# Altium schematic sheet Bidirect_convertor.SchDoc
size A3
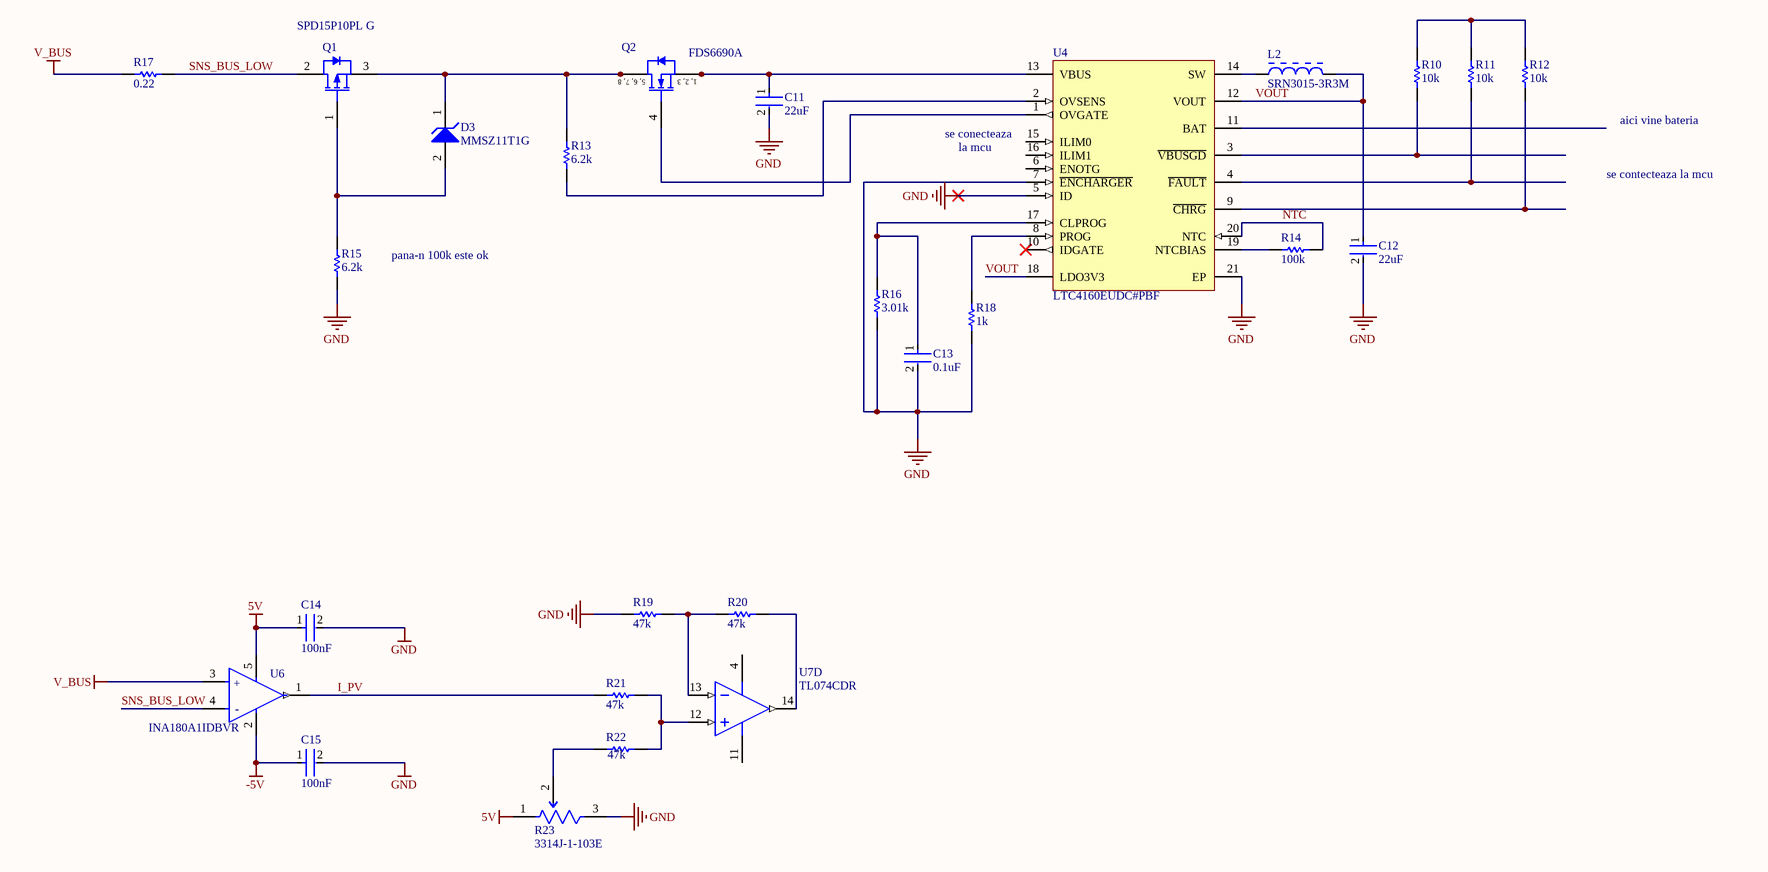
[diagram p0: Bidirect_convertor.SchDoc]

## Parts
C11  22uF  [FP-C2012-125-0_2-IPC_C]
C12  22uF  [FP-C2012-125-0_2-IPC_C]
C13  0.1uF  [FP-GRM155-0_05-MFG]
C14  100nF  [FP-CGA3E-0_3-0_1-IPC_A]
C15  100nF  [FP-CGA3E-0_3-0_1-IPC_A]
D3  MMSZ11T1G  [ONSC-SOD-123-2-425-04_V]
L2  SRN3015-3R3M  [BOUR-SRN3015-2_V]
Q1  SPD15P10PL G  [INF-PG-TO252-3-1_N]
Q2  FDS6690A  [FAIR-SOIC-8_V]
R10  10k  [RESC1609X55X30LL15T15]
R11  10k  [RESC1609X55X30LL15T15]
R12  10k  [RESC1609X55X30LL15T15]
R13  6.2k  [RESC1609X50X30ML10T20]
R14  100k  [RESC1608X55X30ML15T15]
R15  6.2k  [RESC1609X50X30ML10T20]
R16  3.01k  [RESC1608X55X30LL15T15]
R17  0.22  [RESC2013X70X40NL20T20]
R18  1k  [RESC1608X55X30LL15T15]
R19  47k  [RESC1608X55X30NL15T15]
R20  47k  [RESC1608X55X30NL15T15]
R21  47k  [RESC1608X55X30NL15T15]
R22  47k  [RESC1608X55X30NL15T15]
R23  3314J-1-103E  [FP-3314J-1-MFG]
U4  LTC4160EUDC#PBF  [LT-UDC-20_N]
U6  INA180A1IDBVR  [FP-DBV0005A-IPC_A]
U7  TL074CDR  [D0014A_N]  (part D of 4)

## Nets
5V: C14.1 R23.1(CCW) U6.5(VS)
-5V: C15.1 U6.2(GND)
GND: C11.2 C12.2 C13.2 C14.2 C15.2 R15.1 R16.1 R18.1 R19.2 R23.3(CW) U4.5(ID) U4.7(~{ENCHARGER}) U4.21(EP)
V_BUS: R17.1 U6.3(IN+)
I_PV: R21.2 U6.1(OUT)
NTC: R14.2 U4.20(NTC)
SNS_BUS_LOW: Q1.2(DRAIN) R17.2 U6.4(IN-)
VOUT: C12.1 L2.2 U4.12(VOUT) U4.18(LDO3V3)
NetC11_1: C11.1 Q2.1(S) Q2.2(S) Q2.3(S) U4.13(VBUS)
NetC13_1: C13.1 R16.2 U4.17(CLPROG)
NetD3_1: D3.1(K) Q1.3(SOURCE) Q2.5(D) Q2.6(D) Q2.7(D) Q2.8(D) R13.2
NetD3_2: D3.2(A) Q1.1(GATE) R15.2
NetL2_1: L2.1 U4.14(SW)
NetQ2_4: Q2.4(G) U4.1(OVGATE)
NetR10_1: R10.1 U4.3(~{VBUSGD})
NetR10_2: R10.2 R11.2 R12.2
NetR11_1: R11.1 U4.4(~{FAULT})
NetR12_1: R12.1 U4.9(~{CHRG})
NetR13_1: R13.1 U4.2(OVSENS)
NetR14_1: R14.1 U4.19(NTCBIAS)
NetR18_2: R18.2 U4.8(PROG)
NetR19_1: R19.1 R20.2 U7.13(IN4-)
NetR20_1: R20.1 U7.14(OUT4)
NetR21_1: R21.1 R22.1 U7.12(IN4+)
NetR22_2: R22.2 R23.2(WIPER)

Not connected (* = marked no-connect by the designer): U4 6(ENOTG) 10(IDGATE)* 11(BAT) 15(ILIM0) 16(ILIM1); U7 4(VCC+) 11(VCC-)

## Notes on the sheet
- aici vine bateria
- (near U4) se conecteaza
- la mcu
- se contecteaza la mcu
- pana-n 100k este ok
- (in symbol CMP-2000-06260-1) 5, 6, 7, 8; 1, 2, 3
- (in symbol CMP-04895-000140-1) +; -

## Library data of the parts
C11 C12 = CMP-2000-06037-3: Multilayer Ceramic Capacitors 22μF ±10% 16V X5R SMD 0805; Thickness: 0.057inch; Series: C; Weight: 0.000194oz; Construction: Flat; Max Operating Temperature: 85°C; Case Code (Imperial): 0805; Width: 0.049inch; Depth: 1.25mm; Dielectric: X5R; Capacitance: 22uF; Case/Package: 0805; Voltage Rating: 16V; Mount: Surface Mount; Dielectric Material: Ceramic; Packaging: Tape and Reel; Resistor Type: Ceramic; Number of Pins: 2; Lead Free: Lead Free; REACH SVHC: No SVHC; Tolerance: 10%; Termination: Wraparound; Min Operating Temperature: -55°C; Case Code (Metric): 2012; RoHS Compliant: Yes; Voltage: 16V; Length: 2mm; Voltage Rating (DC): 16V; Package Quantity: 1; Height: 1.25mm
C13 = CMP-2008-04599-2: CAP CER 0.1UF 16V X7R 0402; Tolerance: 5%; Capacitance: 100nF; Height: 0.5mm; Min Operating Temperature: -55°C; Voltage Rating: 16V; Termination: Standard; Dielectric: X7R; Max Operating Temperature: 125°C; Package Quantity: 10000; Case/Package: 0402; Case Code (Metric): 1005; Depth: 0.5mm; Voltage: 16V; Width: 0.5mm; RoHS Compliant: Yes; Length: 1mm; Case Code (Imperial): 0402; Thickness: 0.022inch; Mount: Surface Mount; REACH SVHC: No SVHC; Weight: 0.000212oz; Voltage Rating (DC): 16V; Series: GRM; Packaging: Cut Tape; Radiation Hardening: No; Lead Free: Lead Free
C14 C15 = CMP-2000-07546-2: Cap Ceramic 100nF 50V X7R 10% Pad SMD 0603 +125°C Automotive T/R; Weight: 7.1E-05oz; Composition: Ceramic; Max Operating Temperature: 125°C; Termination: SMD/SMT; Dielectric: X7R; Length: 1.6mm; Package Quantity: 1; REACH SVHC: No SVHC; Lead Free: Lead Free; Case Code (Metric): 1608; Min Operating Temperature: -55°C; Packaging: Tape and Reel; Tolerance: 10%; Voltage Rating: 50V; Case Code (Imperial): 0603; Capacitance: 100nF; Case/Package: 0603; Voltage Rating (DC): 50V; Depth: 0.8mm; Radiation Hardening: No; Ratings: AEC-Q200; Mount: Surface Mount; Voltage: 50V; Thickness: 0.035inch; Width: 0.8mm; Height: 0.8mm
D3 = CMP-1060-00402-1: Zener Voltage Regulator, 500 mW, 2-Pin SOD-123, Pb-Free, Tape and Reel; Manufacturer: On Semiconductor; P Max (W): 0.5; ComponentLink2URL: http://www.onsemi.com/pub_link/Collateral/MMSZ2V4T1-D.PDF; DatasheetVersion: Rev. 11; ComponentLink1Description: Manufacturer URL; ComponentLink3URL: http://www.onsemi.com/pub_link/Collateral/425-04.PDF; ComponentLink1URL: http://www.onsemi.com/; PackageDescription: 2-Pin SOD, Body 1.6 x 2.69 mm; PackageVersion: Rev. G, 10/2009; ComponentLink3Description: Package Specification; ComponentLink2Description: Datasheet; Mounting Technology: Surface Mount; PartNumber: MMSZ11T1G; RoHS: Pb-Free; Packing: Tape and Reel; PackageReference: SOD-123-2-425-04
L2 = CMP-0007-00001-1: Semi-shielded Power Inductor, 3.3 uH, +/- 20%, 1.6 A, -40 to 125 degC, 3 x 3 x 1.5 mm SMD, RoHS and Halogen Free, Tape and Reel; Manufacturer: Bourns; DCR Max: 0.112 Ohm; Resistance to Solder Heat: +260 degC for 10 sec.; Inductance: 3.3 uH; Rated current: 1.6 A; SRF Min: 75 MHz; Isat: 1.4 A; Inductance tolerance: +/- 20%; PackageDescription: 2-Pin SMD, Body 3 x 3 mm, Height 1.5 mm; ComponentLink1URL: http://www.bourns.com/; ComponentLink3URL: http://www.bourns.com/data/global/pdfs/SRN3015.pdf; RoHS: TRUE; ComponentLink2URL: http://www.bourns.com/data/global/pdfs/SRN3015.pdf; DatasheetVersion: Aug-11; ComponentLink3Description: Package Specification; PartNumber: SRN3015-3R3M; ComponentLink2Description: Datasheet; Packing: Tape and Reel; ComponentLink1Description: Manufacturer URL; Mounting Technology: Surface Mount; PackageReference: SRN3015; Operating Temperature: -40 to 125 degC
Q1 = CMP-1099-00052-1: P-Channel SIPMOS Power-Transistor, -100 V VDS, -15 A ID, -55 to 175 degC, PG-TO252-3-1, Reel, Green; Manufacturer: Infineon; Pto t (max): 128Â W; RDS (on) (max): 200Â mOhm; ID (max): -15Â A; VDS (max): -100Â V; RDS (on) (max) (@4.5V): 270Â mOhm; IDpuls (max): -60Â A; VGS(th) (max): -2Â V; QG: 47Â nC; Mode: Enhancement; Rth: 1.17Â K/W; VGS(th) (min): -1Â V; Polarity: P; Green: TRUE; PackageReference: PG-TO252-3-1; Mounting Technology: Surface Mount; ComponentLink1Description: Manufacturer URL; ComponentLink3Description: Package Specification; DatasheetVersion: Rev. 1.5; ComponentLink2Description: Datasheet; PackageDescription: 3-Pin Plastic (Green) Transistor Single Outline Package, 6.5 x 6.12 mm Body, 2.28 mm Pitch; Technology: SIPMOS; ComponentLink2URL: http://www.infineon.com/dgdl/SPD15P10PL%2BG_Rev1.5.pdf?folderId=db3a304314dca38901154a72e3951a65&fileId=db3a30433c1a8752013c39ff5f2e4af3; ComponentLink3URL: http://www.infineon.com/dgdl/TLE42744_DS_11.pdf?folderId=db3a304318f3fe290118f5a433570040&fileId=db3a304327b897500128012ccafe37d2&sId=db3a30443d67b5ca013d83f7c0ea327b; Packing: Reel; ComponentLink1URL: http://www.infineon.com/; PackageVersion: Jan-10; PartNumber: SPD15P10PL G
Q2 = CMP-2000-06260-1: Single N-Channel, Logic-Level, PowerTrench(R) MOSFET, 11 A, 30 V, -55 to 150 degC, 8-Pin SOIC (SO-8), RoHS, Tape and Reel; Manufacturer: Fairchild Semiconductor; Typical Turn-Off Delay Time: 28ns; Transistor Material: Si; Typical Turn-On Delay Time: 9ns; Channel Mode: Enhancement; Maximum Power Dissipation: 2.5W; Typical Input Capacitance @ Vds: 1205pF@15V; Maximum Continuous Drain Current: 11A; Maximum Gate Source Voltage: ±20V; Channel Type: N; Typical Gate Charge @ Vgs: 12nC@5V; Number of Elements per Chip: 1; Minimum Gate Threshold Voltage: 1V; Maximum Drain Source Resistance: 0.013Ω; Maximum Drain Source Voltage: 30V; Datasheet Version: Rev. E1, 02/2007; Length: 5mm; Category: PowerMOSFET; Mounting Type: SurfaceMount; Pin Count: 8; Minimum Operating Temperature: -55°C; Dimensions: 5x4x1.5mm; Package Type: SOIC; Width: 4mm; Datasheet URL: https://www.fairchildsemi.com/datasheets/FD/FDS6690A.pdf; Manufacturer URL: https://www.fairchildsemi.com/; Package URL: https://www.fairchildsemi.com/package-drawings/M0/M08A.pdf; Mounting Technology: SurfaceMount; Package Reference: SOIC-8; Maximum Operating Temperature: +150°C; Package Description: 8-Pin Small Outline Integrated Circuit, Body 4.9 x 3.9 mm, Pitch 1.27 mm; Transistor Configuration: Single; Height: 1.5mm
R10-R12 = CMP-1012-00623-3: Chip Resistor, 10 KOhm, +/- 1%, 0.1 W, -55 to 155 degC, 0603 (1608 Metric), RoHS, Tape and Reel; Manufacturer: Panasonic; Voltage Rating: 75V; Case\/Package: 0603; Power Rating: 100mW; Resistance: 10KOhm; Temperature Coefficient: 100ppm\/degreesC; Number of Pins: 2; Package Reference: 603; Depth: 0.8mm; Mount: SurfaceMount; Package Description: 2-Pin Surface Mount Device, Body 1.6 x 0.85 mm; Datasheet Version: 02/2017; Length: 1.6mm; Lead Free: LeadFree; Height: 0.45mm; Number of Terminations: 2; Max Power Dissipation: 100mW; Min Operating Temperature: -55degC; Datasheet URL: https://industrial.panasonic.com/cdbs/www-data/pdf/RDA0000/AOA0000C304.pdf; Termination: SMD/SMT; Case Code (Metric): 1608; Case Code (Imperial): 0603; Tolerance: 1%; Max Operating Temperature: 155degC; RoHSCompliant: true; Voltage Rating (DC): 75V; Radiation Hardening: No; Packaging: TapeandReel; Composition: ThickFilm; Mounting Technology: SurfaceMount; Manufacturer URL: http://www.panasonic.com/; Width: 0.031inch; REACH SVHC: NoSVHC; Contact Plating: Tin; Military Standard: Not; Package Quantity: 1
R13 R15 = CMP-2000-03545-1: Part Number: CRCW06036K20FKEA; Manufacturer: Vishay Dale
R14 = CMP-2000-00182-1: Part Number: ERJ-3EKF1003V; Manufacturer: Panasonic
R16 = CMP-2000-00416-1: Part Number: ERJ-3EKF3011V; Manufacturer: Panasonic
R17 = CMP-2001-00466-1: Manufacturer: Panasonic; Part Number: ERJ6RQFR22V
R18 = CMP-2000-00180-1: Part Number: ERJ-3EKF1001V; Manufacturer: Panasonic
R19-R22 = CMP-2000-00523-2: Chip Resistor, 47 KOhm, +/- 1%, 0.1 W, -55 to 155 degC, 0603 (1608 Metric), RoHS, Tape and Reel; Case\Package: 0603; Forward Current: 20 mA; Power Rating: 90 mW; Illumination Colour: Red; Nominal Vf: 2.1 V; Viewing Angle: 160 degrees; Luminous Intensity: 63 mcd; Lens Style: Clear; Nominal Wavelength: 639 nm; Case Code (Imperial): 0603; Case Code (Metric): 1608; Packaging: Tape and Reel; Radiation Hardening: No; Colour: Red; PackageDescription: 2-Pin Surface Mount Device, Body 1.6 x 0.85 mm; ComponentLink1Description: Manufacturer URL; Width: 0.8 mm; DatasheetVersion: Apr-15; ComponentLink2URL: http://industrial.panasonic.com/cdbs/www-data/pdf/RDA0000/AOA0000C86.pdf; Min Operating Temperature: -40 degC; Height: 0.6 mm; Package Quantity: 3000; ComponentLink2Description: Datasheet; REACH SVHC: No SVHC; ComponentLink1URL: http://www.panasonic.com/; Mount: Surface Mount; RoHSCompliant: true; Max Operating Temperature: 100 degC; PackageReference: 0603; Length: 1.6 mm; Forward Voltage: 2.1 V; Pins: 2
R23 = CMP-07234-000035-1: TRIMMER 10K OHM 0.25W J LEAD TOP; RoHS Compliant: Yes
U4 = CMP-0478-00217-1: Switching Power Manager with USB On-The-Go And Overvoltage Protection, 4.35 to 5.5 V Vin, 20-pin QFN (UDC-20), -40 to 85 degC, Pb-Free; Manufacturer: Linear Technology; Number of Outputs: 1; Vin Min(V): 4.35; Vin Max(V): 5.5; ComponentLink2URL: http://cds.linear.com/docs/en/datasheet/41601fa.pdf; PackageDescription: 20-Pin Plastic QFN, Body 3 x 4 mm, Pitch 0.5 mm; PartNumber: LTC4160EUDC#PBF; DatasheetVersion: Rev. A; ComponentLink3URL: http://cds.linear.com/docs/en/packaging/QFN_20_05-08-1742.pdf; PackageReference: UDC20; RoHS: TRUE; Mounting Technology: Surface Mount; ComponentLink1URL: http://www.linear.com/; ComponentLink1Description: Manufacturer URL; PackageVersion: Rev. Ã˜, 06/2010; ComponentLink2Description: Datasheet; Number of Cells: 1; ComponentLink3Description: Package Specification
U6 = CMP-04895-000140-1: IC CURR SENSE 1 CIRCUIT SOT23-5; Input Bias Current: 100nA; Input Offset Voltage (Vos): 100uV; Number of Circuits: 1; Slew Rate: 2V/µs; -3db Bandwidth: 350kHz; Operating Supply Current: 260uA; Case/Package: SOT-23-5; Min Operating Temperature: -40°C; Mount: Surface Mount; Packaging: Tape and Reel; Max Operating Temperature: 125°C
U7 = CMP-0017-00003-2: Quad Low-Noise JFET-Input General-Purpose Operational Amplifier, 7 to 36 V, 0 to 70 degC, 14-pin SOIC (D14), Green (RoHS & no Sb/Br); Manufacturer: Texas Instruments; Slew Rate(Typ)(V/us): 13; IIB(Max)(pA): 200; Number of Channels: 4; CMRR(Min)(dB): 70; Vn at 1kHz(Typ)(nV/rtHz): 18; Vio (25C)(Max)(mV): 10; Sub Family: General Purpose Amplifier, High Supply Voltage Amplifier (>=30V); Total Supply Voltage(Max)(+5V is 5, +/-5V is 10): 36; Total Supply Voltage(Min)(+5V is 5, +/-5V is 10): 7; GBW(Typ)(MHz): 3; Rating: Military; Iq per channel(Max)(mA): 2.5; Eco-Plan: Green (RoHS & no Sb/Br); ComponentLink3Description: Package Specification; ComponentLink1URL: http://www.ti.com/; Mounting Technology: Surface Mount; ComponentLink3URL: http://www.ti.com/lit/ml/mpds177g/mpds177g.pdf; PartNumber: TL074CDR; DatasheetVersion: SLOS080J; ComponentLink2URL: http://www.ti.com/lit/ds/symlink/tl074.pdf; ComponentLink1Description: Manufacturer URL; PackageVersion: 4040047-5/M, 06/2011; PackageReference: D0014A; Code_JEDEC: MS-012; ComponentLink2Description: Datasheet; Offset Drift(Typ)(uV/C): 18; PackageDescription: 14-Pin Plastic Small Outline, Body 8.65 x 3.90 mm, Pitch 1.27 mm